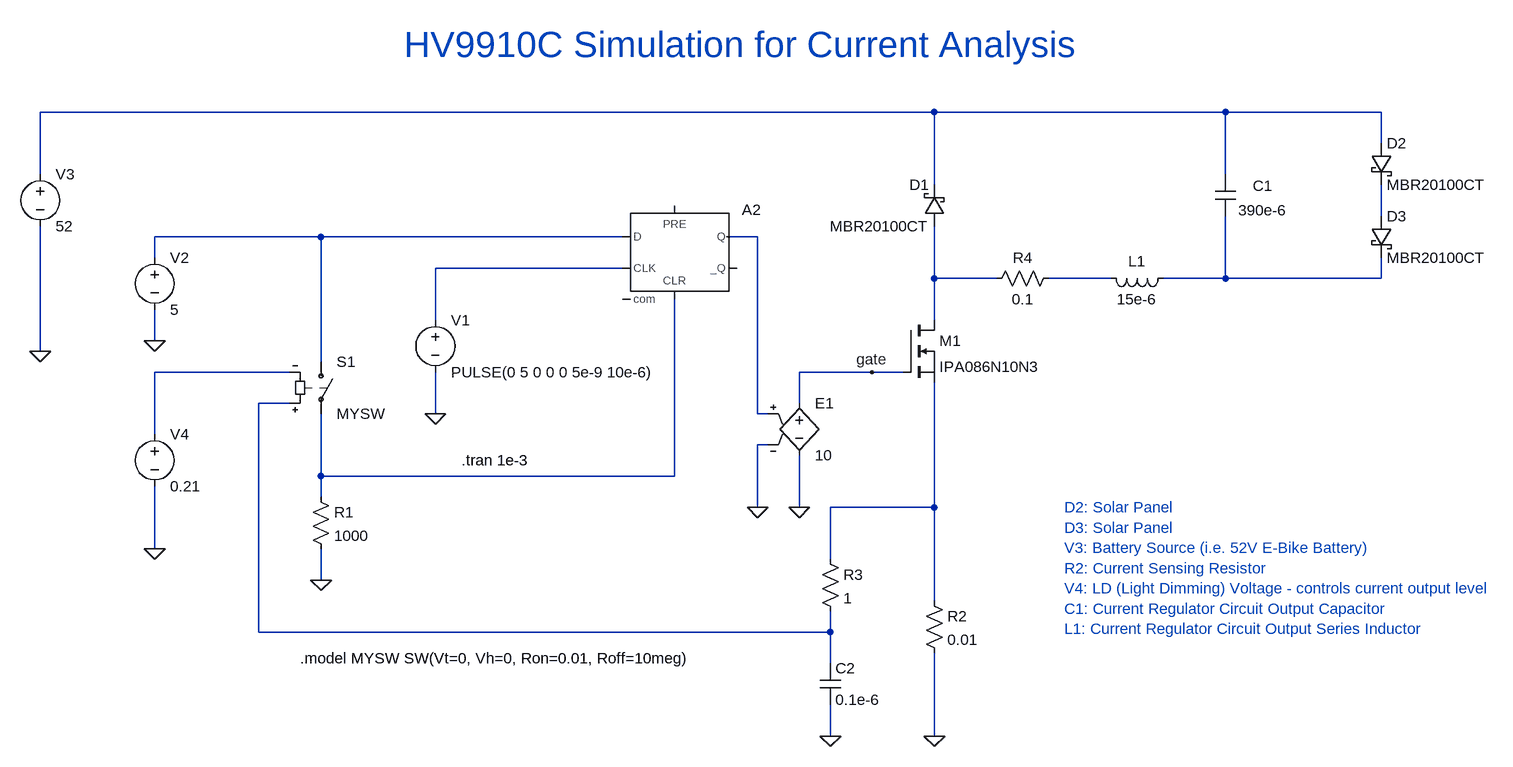
[diagram p0: schematic LT spice model hv9910c v3 - nabradb.asc]
LT spice model hv9910c v3 - nabradb.asc, the LTspice schematic file:
Version 4
SHEET 1 1308 884
WIRE 384 -192 -992 -192
WIRE 832 -192 384 -192
WIRE 1072 -192 832 -192
WIRE 1072 -144 1072 -192
WIRE -992 -96 -992 -192
WIRE 832 -96 832 -192
WIRE 384 -80 384 -192
WIRE 1072 -32 1072 -80
WIRE -560 0 -816 0
WIRE -96 0 -560 0
WIRE 112 0 64 0
WIRE -816 32 -816 0
WIRE -96 48 -384 48
WIRE 384 64 384 -16
WIRE 480 64 384 64
WIRE 656 64 560 64
WIRE 832 64 832 -32
WIRE 832 64 736 64
WIRE 1072 64 1072 32
WIRE 1072 64 832 64
WIRE -384 128 -384 48
WIRE 384 128 384 64
WIRE -816 160 -816 112
WIRE -992 176 -992 -16
WIRE -560 192 -560 0
WIRE -608 208 -816 208
WIRE 288 208 176 208
WIRE 336 208 288 208
WIRE -608 256 -656 256
WIRE 176 256 176 208
WIRE -384 272 -384 208
WIRE 112 272 112 0
WIRE 128 272 112 272
WIRE -816 304 -816 208
WIRE 128 320 112 320
WIRE -560 368 -560 272
WIRE -16 368 -16 96
WIRE -16 368 -560 368
WIRE -560 400 -560 368
WIRE 112 416 112 320
WIRE 176 416 176 336
WIRE 384 416 384 224
WIRE 384 416 224 416
WIRE -816 480 -816 384
WIRE 224 496 224 416
WIRE -560 528 -560 480
WIRE 384 560 384 416
WIRE -656 608 -656 256
WIRE 224 608 224 576
WIRE 224 608 -656 608
WIRE 224 656 224 608
WIRE 224 768 224 720
WIRE 384 768 384 640
FLAG -384 272 0
FLAG -816 160 0
FLAG -560 528 0
FLAG 384 768 0
FLAG -992 176 0
FLAG -816 480 0
FLAG 176 416 0
FLAG 112 416 0
FLAG 224 768 0
FLAG 288 208 gate
SYMBOL voltage -384 112 R0
WINDOW 123 0 0 Left 0
WINDOW 39 0 0 Left 0
SYMATTR InstName V1
SYMATTR Value PULSE(0 5 0 0 0 5e-9 10e-6)
SYMBOL voltage -816 16 R0
WINDOW 123 0 0 Left 0
WINDOW 39 0 0 Left 0
SYMATTR InstName V2
SYMATTR Value 5
SYMBOL sw -560 176 R0
SYMATTR InstName S1
SYMATTR Value MYSW
SYMBOL res -576 384 R0
SYMATTR InstName R1
SYMATTR Value 1000
SYMBOL nmos 336 128 R0
SYMATTR InstName M1
SYMATTR Value IPA086N10N3
SYMBOL res 368 544 R0
SYMATTR InstName R2
SYMATTR Value 0.01
SYMBOL schottky 400 -16 R180
WINDOW 0 24 64 Left 2
WINDOW 3 24 0 Left 2
SYMATTR InstName D1
SYMATTR Value MBR20100CT
SYMATTR Description Diode
SYMATTR Type diode
SYMBOL voltage -992 -112 R0
WINDOW 123 0 0 Left 0
WINDOW 39 0 0 Left 0
SYMATTR InstName V3
SYMATTR Value 52
SYMBOL cap 816 -96 R0
WINDOW 0 58 17 Left 2
WINDOW 3 36 55 Left 2
SYMATTR InstName C1
SYMATTR Value 390e-6
SYMBOL schottky 1056 -144 R0
SYMATTR InstName D2
SYMATTR Value MBR20100CT
SYMATTR Description Diode
SYMATTR Type diode
SYMBOL schottky 1056 -32 R0
SYMATTR InstName D3
SYMATTR Value MBR20100CT
SYMATTR Description Diode
SYMATTR Type diode
SYMBOL voltage -816 288 R0
WINDOW 123 0 0 Left 0
WINDOW 39 0 0 Left 0
SYMATTR InstName V4
SYMATTR Value 0.21
SYMBOL e 176 240 R0
SYMATTR InstName E1
SYMATTR Value 10
SYMBOL Digital\\dflop -16 -48 R0
SYMATTR InstName A2
SYMBOL cap 208 656 R0
SYMATTR InstName C2
SYMATTR Value 0.1e-6
SYMBOL res 208 480 R0
SYMATTR InstName R3
SYMATTR Value 1
SYMBOL res 576 48 R90
WINDOW 0 0 56 VBottom 2
WINDOW 3 32 56 VTop 2
SYMATTR InstName R4
SYMATTR Value 0.1
SYMBOL ind 752 48 R90
WINDOW 0 5 56 VBottom 2
WINDOW 3 32 56 VTop 2
SYMATTR InstName L1
SYMATTR Value 15e-6
TEXT -344 344 Left 2 !.tran 1e-3
TEXT -592 648 Left 2 !.model MYSW SW(Vt=0, Vh=0, Ron=0.01, Roff=10meg)
TEXT 584 416 Left 2 ;D2: Solar Panel\nD3: Solar Panel\nV3: Battery Source (i.e. 52V E-Bike Battery)\nR2: Current Sensing Resistor\nV4: LD (Light Dimming) Voltage - controls current output level\nC1: Current Regulator Circuit Output Capacitor\nL1: Current Regulator Circuit Output Series Inductor
TEXT -432 -296 Left 5 ;HV9910C Simulation for Current Analysis

The netlist it stands for:
* LT spice model hv9910c v3 - nabradb.asc
V1 N005 0 PULSE(0 5 0 0 0 5e-9 10e-6)
V2 N003 0 5
S1 N003 N011 N010 N009 MYSW
R1 N011 0 1000
M1 N006 gate N012 N012 IPA086N10N3
R2 N012 0 0.01
D1 N006 N001 MBR20100CT
V3 N001 0 52
C1 N001 N008 390e-6
D2 N001 N002 MBR20100CT
D3 N002 N008 MBR20100CT
V4 N009 0 0.21
E1 gate 0 N004 0 10
A2 N003 0 N005 0 N011 0 N004 0 DFLOP
C2 N010 0 0.1e-6
R3 N012 N010 1
R4 N007 N006 0.1
L1 N008 N007 15e-6
.model D D
.lib standard.dio
.model NMOS NMOS
.model PMOS PMOS
.lib standard.mos
.tran 1e-3
.model MYSW SW(Vt=0, Vh=0, Ron=0.01, Roff=10meg)
* D2: Solar Panel
* D3: Solar Panel
* V3: Battery Source (i.e. 52V E-Bike Battery)
* R2: Current Sensing Resistor
* V4: LD (Light Dimming) Voltage - controls current output level
* C1: Current Regulator Circuit Output Capacitor
* L1: Current Regulator Circuit Output Series Inductor
* HV9910C Simulation for Current Analysis
.backanno
.end